# EAGLE design oneboard (EAGLE 6.1)
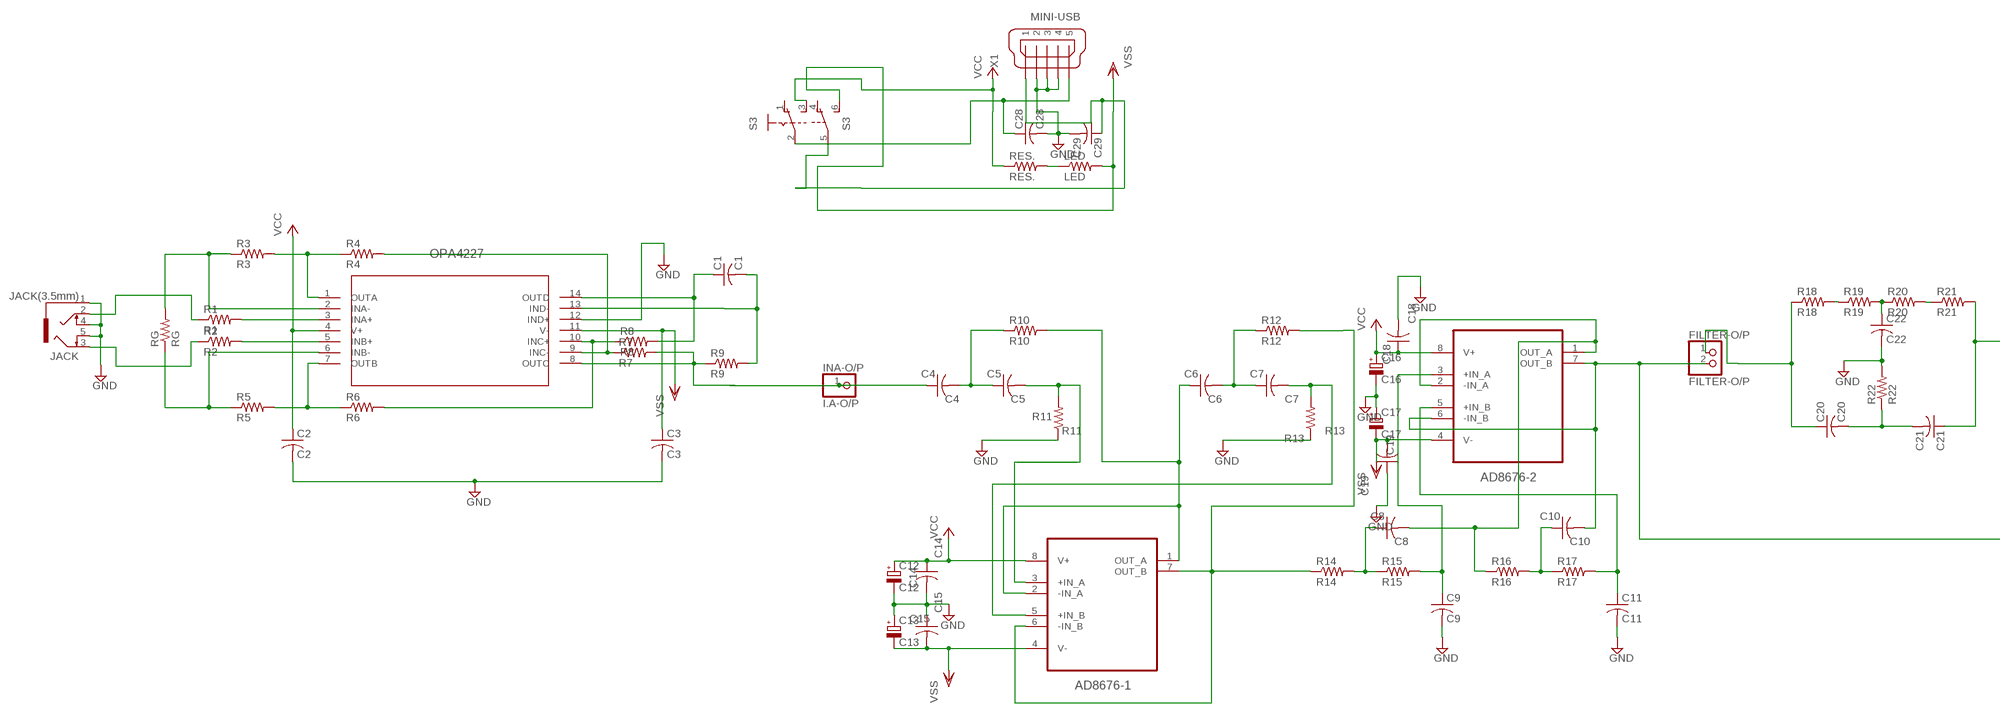
[diagram p0: schematic, sheet 1, part 1 of 2]
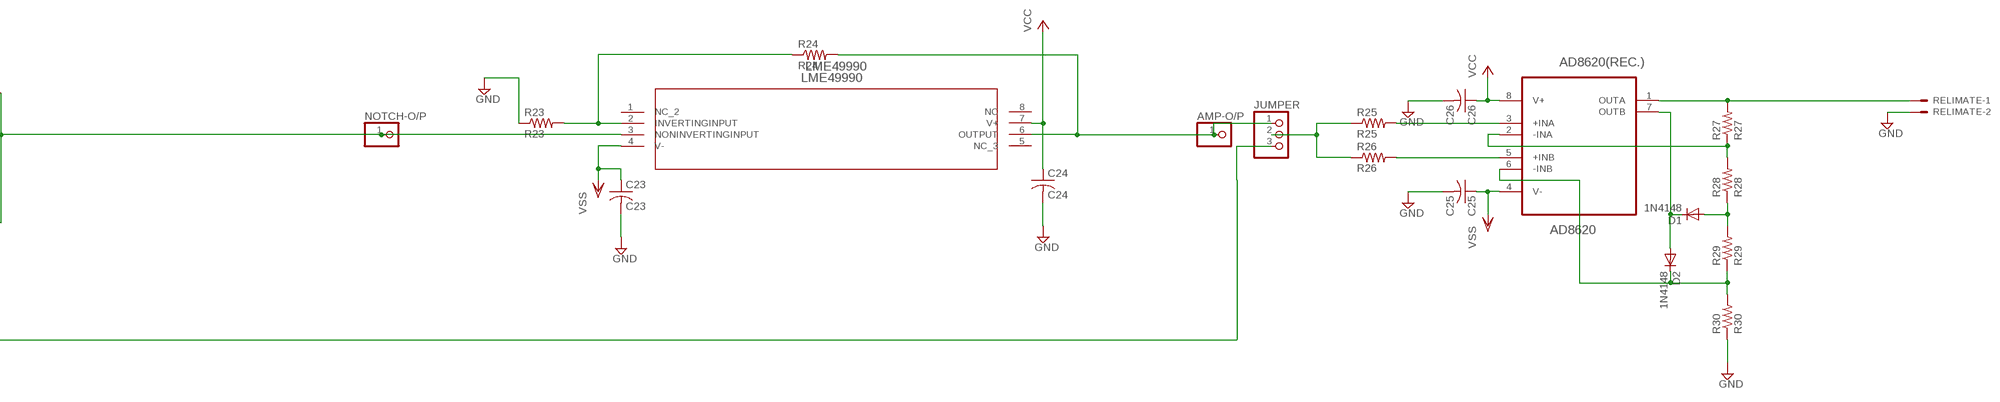
[diagram p1: schematic, sheet 1, part 2 of 2]

## Parts
AD8620(REC.)  AD8620  AD8620ARZ  [SOIC127P600X175-8N]
AD8676-1  AD8676-1  AD8676ARZ  [SOIC127P600X175-8N]
AD8676-2  AD8676-2  AD8676ARZ  [SOIC127P600X175-8N]
AMP-O/P  PINHD-1X1  [1X01]
C1  C1  C-USC0603  [C0603]
C2  C2  C-USC0603  [C0603]
C3  C3  C-USC0603  [C0603]
C4  C4  C-USC0603  [C0603]
C5  C5  C-USC0603  [C0603]
C6  C6  C-USC0603  [C0603]
C7  C7  C-USC0603  [C0603]
C8  C8  C-USC0603  [C0603]
C9  C9  C-USC0603  [C0603]
C10  C10  C-USC0603  [C0603]
C11  C11  C-USC0603  [C0603]
C12  C12  CPOL-EUE2-5  [E2-5]
C13  C13  CPOL-EUE2-5  [E2-5]
C14  C14  C-USC0603  [C0603]
C15  C15  C-USC0603  [C0603]
C16  C16  CPOL-EUE2-5  [E2-5]
C17  C17  CPOL-EUE2-5  [E2-5]
C18  C18  C-USC0603  [C0603]
C19  C19  C-USC0603  [C0603]
C20  C20  C-USC0603  [C0603]
C21  C21  C-USC0603  [C0603]
C22  C22  C-USC0603  [C0603]
C23  C23  C-USC0603  [C0603]
C24  C24  C-USC0603  [C0603]
C25  C25  C-USC0603  [C0603]
C26  C26  C-USC0603  [C0603]
C28  C28  C-USC0603  [C0603]
C29  C29  C-USC0603  [C0603]
D1  1N4148  1N4148DO35-10  [DO35-10]
D2  1N4148  1N4148DO35-10  [DO35-10]
FILTER-O/P  FILTER-O/P  PINHD-1X2  [1X02]
INA-O/P  I.A-O/P  PINHD-1X1  [1X01]
JACK  JACK(3.5mm)  1503_09  [1503_09]
JUMPER  PINHD-1X3  [1X03]
LED  LED  R-US_R0805  [R0805]
LME49990  LME49990  LME49990_D_8  [M08A]
NOTCH-O/P  PINHD-1X1  [1X01]
OPA4227  OPA4277_D_14  [D14]
R1  R1  R-US_R0603  [R0603]
R2  R2  R-US_R0603  [R0603]
R3  R3  R-US_R0603  [R0603]
R4  R4  R-US_R0603  [R0603]
R5  R5  R-US_R0603  [R0603]
R6  R6  R-US_R0603  [R0603]
R7  R7  R-US_R0603  [R0603]
R8  R8  R-US_R0603  [R0603]
R9  R9  R-US_R0603  [R0603]
R10  R10  R-US_R0603  [R0603]
R11  R11  R-US_R0603  [R0603]
R12  R12  R-US_R0603  [R0603]
R13  R13  R-US_R0603  [R0603]
R14  R14  R-US_R0603  [R0603]
R15  R15  R-US_R0603  [R0603]
R16  R16  R-US_R0603  [R0603]
R17  R17  R-US_R0603  [R0603]
R18  R18  R-US_R0603  [R0603]
R19  R19  R-US_R0603  [R0603]
R20  R20  R-US_R0603  [R0603]
R21  R21  R-US_R0603  [R0603]
R22  R22  R-US_R0603  [R0603]
R23  R23  R-US_R0603  [R0603]
R24  R24  R-US_R0603  [R0603]
R25  R25  R-US_R0603  [R0603]
R26  R26  R-US_R0603  [R0603]
R27  R27  R-US_R0603  [R0603]
R28  R28  R-US_R0603  [R0603]
R29  R29  R-US_R0603  [R0603]
R30  R30  R-US_R0603  [R0603]
RELIMATE  22-23-2021  [22-23-2021]
RES.  RES.  R-US_R0603  [R0603]
RG  RG  R-US_R0603  [R0603]
S3  A68-A31  [A68-A31]
X1  MINI-USB  MINI-USB-UX60-MB-5S8  [UX60-MB-5S8]

## Nets
1: C21.1 LME49990.3(NONINVERTINGINPUT) NOTCH-O/P.1 R21.2
5: C29.1 S3.5(B:P) X1.1
GND: C2.2 C3.2 C9.2 C11.2 C12.- C13.+ C14.2 C15.1 C16.- C17.+ C18.2 C19.1 C22.2 C23.2 C24.2 C25.2 C26.2 C28.2 C29.2 JACK.1 JACK.4 JACK.5 OPA4227.12(IND+) R11.1 R13.1 R22.2 R23.1 R30.1 RELIMATE.2 X1.2 X1.3 X1.4
H-O/P: AD8676-1.6(-IN_B) AD8676-1.7(OUT_B) R12.2 R14.1
N$1: OPA4227.3(INA+) R1.2
N$2: OPA4227.5(INB+) R2.2
N$3: JACK.3 R2.1
N$4: JACK.2 R1.1
N$5: OPA4227.1(OUTA) R3.2 R4.1
N$6: OPA4227.2(INA-) R3.1 RG.2
N$7: OPA4227.9(INC-) R4.2 R7.1
N$9: OPA4227.6(INB-) R5.1 RG.1
N$10: OPA4227.10(INC+) R6.2 R8.1
N$11: C1.2 OPA4227.13(IND-) R9.2
N$12: C4.2 C5.1 R10.1
N$13: C1.1 OPA4227.14(OUTD) R8.2
N$14: C4.1 INA-O/P.1 OPA4227.8(OUTC) R7.2 R9.1
N$15: AD8676-1.3(+IN_A) C5.2 R11.2
N$16: AD8676-1.1(OUT_A) AD8676-1.2(-IN_A) C6.1 R10.2
N$17: C6.2 C7.1 R12.1
N$18: AD8676-1.5(+IN_B) C7.2 R13.2
N$19: C8.1 R14.2 R15.1
N$20: AD8676-2.3(+IN_A) C9.1 R15.2
N$21: C10.1 R16.2 R17.1
N$22: AD8676-2.5(+IN_B) C11.1 R17.2
N$23: AD8676-2.1(OUT_A) AD8676-2.2(-IN_A) C8.2 R16.1
N$24: AD8620(REC.).3(+INA) R25.2
N$25: C22.1 R19.2 R20.1
N$26: LED.1 RES..2
N$27: C20.2 C21.2 R22.1
N$28: R18.2 R19.1
N$29: R20.2 R21.1
N$30: AD8620(REC.).5(+INB) R26.2
N$31: JUMPER.2 R25.1 R26.1
N$32: AD8676-2.6(-IN_B) AD8676-2.7(OUT_B) C10.2 FILTER-O/P.2 JUMPER.3
N$33: C20.1 FILTER-O/P.1 R18.1
N$34: AD8620(REC.).2(-INA) R27.1 R28.2
N$35: AD8620(REC.).1(OUTA) R27.2 RELIMATE.1
N$36: D1.A R28.1 R29.2
N$37: AD8620(REC.).6(-INB) D2.C R29.1 R30.2
N$38: AD8620(REC.).7(OUTB) D1.C D2.A
N$39: LME49990.2(INVERTINGINPUT) R23.2 R24.1
N$40: AMP-O/P.1 JUMPER.1 LME49990.6(OUTPUT) R24.2
N$41: C28.1 S3.2(A:P) X1.5
R6: OPA4227.7(OUTB) R5.2 R6.1
VCC: AD8620(REC.).8(V+) AD8676-1.8(V+) AD8676-2.8(V+) C2.1 C12.+ C14.1 C16.+ C18.1 C24.1 C26.1 LME49990.7(V+) OPA4227.4(V+) RES..1 S3.3(A:S)
VSS: AD8620(REC.).4(V-) AD8676-1.4(V-) AD8676-2.4(V-) C3.1 C13.- C15.2 C17.- C19.2 C23.1 C25.1 LED.2 LME49990.4(V-) OPA4227.11(V-) S3.6(B:S)
Unconnected: LME49990.1(NC_2) LME49990.5(NC_3) LME49990.8(NC) S3.1(A:O) S3.4(B:O)

## Library data of the parts
AD8620(REC.) = Analog Devices_By_element14_Batch_1:AD8620ARZ: Precision, Very Low Noise,Low Input Bias Current, Wide Bandwidth JFET Operational Amplifiers; MPN: AD8620ARZ; OC_FARNELL: 9994386; OC_NEWARK: 59K6972; PACKAGE: SOIC-8; SUPPLIER: Analog Devices
AD8676-1 AD8676-2 = Analog Devices_By_element14_Batch_1:AD8676ARZ: Ultraprecision, 36 V, 2.8 nV/ãHz Dual Rail-to-Rail Output Op Amp; MPN: AD8676ARZ; OC_FARNELL: 1316453; OC_NEWARK: 28M4146; PACKAGE: SOIC-8; SUPPLIER: Analog Devices
AMP-O/P INA-O/P NOTCH-O/P = pinhead:PINHD-1X1: PIN HEADER
C1-C11 C14 C15 C18-C26 C28 C29 = rcl:C-US: CAPACITOR, American symbol
C12 C13 C16 C17 = rcl:CPOL-EU: POLARIZED CAPACITOR, European symbol
D1 D2 = diode:1N4148: DIODE high speed (Philips)
FILTER-O/P = pinhead:PINHD-1X2: PIN HEADER
JACK = con-lumberg:1503_09: Jack connectors according to JISC 6560, 3.5 mm Klinkeneinbaukupplung nach JISC 6560, 3,5 mm, 3-polig/ stereo, abgewinkelte Ausführung, mit 2 Öffnern und Lötaugen, für Leiterplatten Rückseitenmontage Source: http://www.lumberg.com/Produkte/PDFs/1503_09.pdf; OC_FARNELL: 1243244; OC_NEWARK: unknown
JUMPER = pinhead:PINHD-1X3: PIN HEADER
LED R10-R30 RES. = rcl:R-US_: RESISTOR, American symbol
LME49990 = lme49990:LME49990_D_8; BASEPN: LME49990; DATASHEETURL: http://www.ti.com/lit/ds/symlink/lme49990.pdf; DESCRIPTION: Ultra-low Distortion, Ultra-low Noise Operational Amplifier; MANUFACTURER: Texas Instruments; MANUFACTURER_PART_NUMBER: lme49990_d_8; NSC_PACKAGEREFERENCE: M08A; VENDOR: Texas Instruments
OPA4227 = OPA4277_SOIC:OPA4277_D_14; DATASHEETURL: http://www.ti.com/lit/gpn/OPA4277; DESCRIPTION: High Precision Operational Amplifiers; FAMILY_NAME: LOW OFFSET VOLTAGE; GENERIC_PART_NUMBER: OPA4277; INDUSTRY_STD_PKG_TYPE: SOIC; MANUFACTURER: Texas Instruments; MANUFACTURER_PART_NUMBER: opa4277_d_14; PACKAGE_DESIGNATOR: D; PIN_COUNT: 14; VENDOR: Texas Instruments
R1-R9 RG = resistor:R-US_: RESISTOR, American symbol
RELIMATE = con-molex:22-23-2021: .100" (2.54mm) Center Header - 2 Pin; MF: MOLEX; MPN: 22-23-2021; OC_FARNELL: 1462926; OC_NEWARK: 25C3832
S3 = switch:A68-A31: SLIDING SWITCH Siemens, distributor Buerklin, 11G766
X1 = con-hirose:MINI-USB-: MINI USB Connector Source: http://www.hirose.co.jp/cataloge_hp/e24000019.pdf; OC_FARNELL: unknown; OC_NEWARK: unknown

## Board
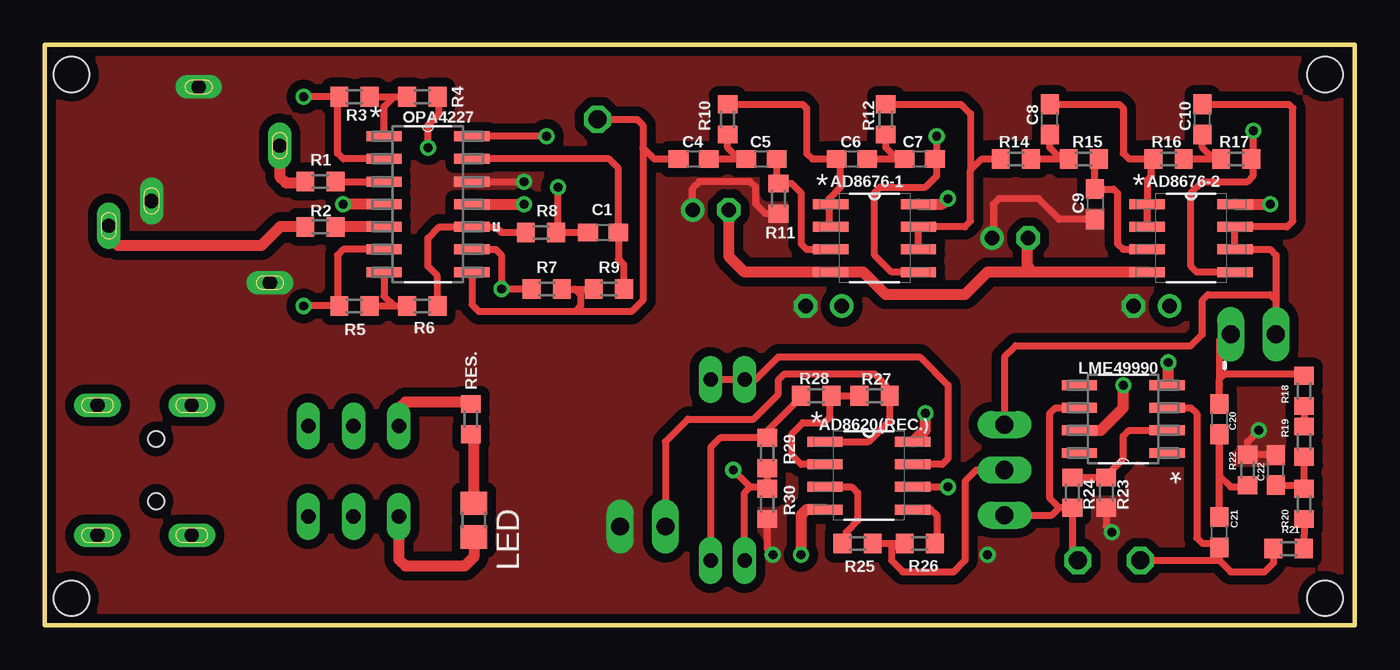
[diagram p2: board, top side]
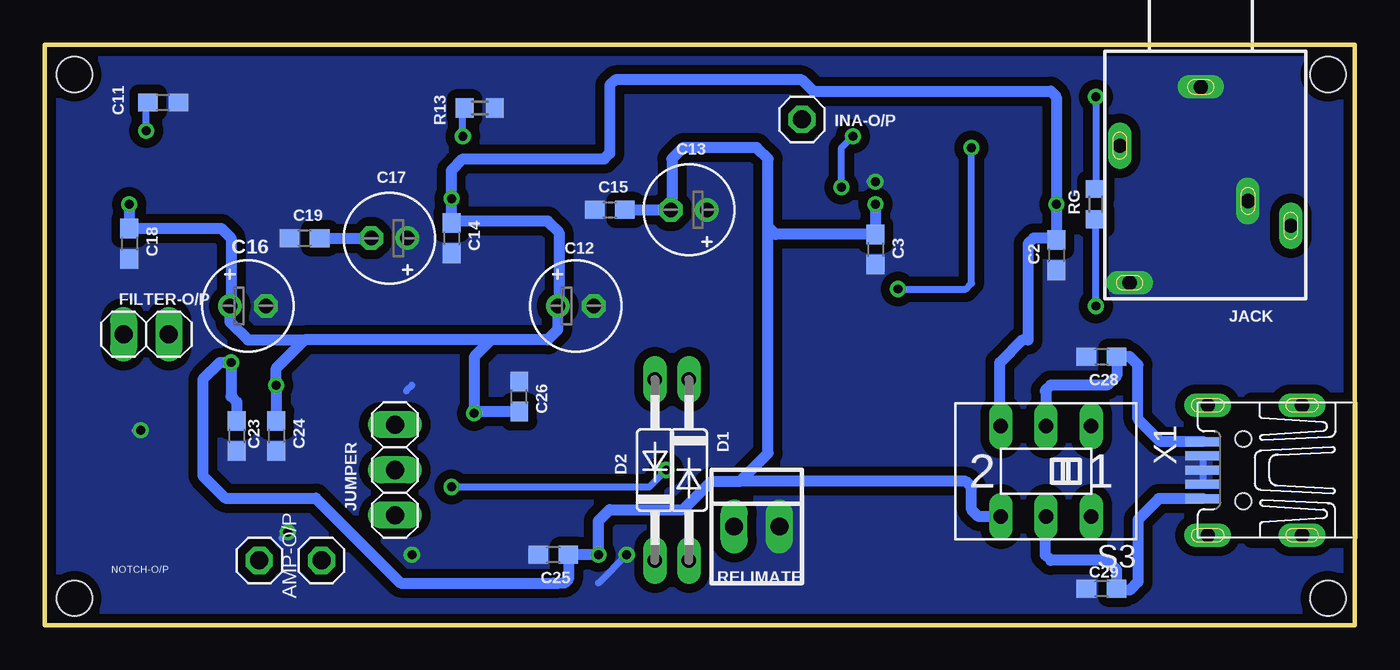
[diagram p3: board, bottom side, seen from below]

Size 73.61 x 32.61 mm. Coordinates in mm from the lower left corner, seen from the top.
Outline: 0,0 0,32.61 73.61,32.61 73.61,0 0,0
Copper layers (1*16): Top 0.035mm / dielectric 1.6mm / Bottom 0.035mm
Design rules: minimum track width 10mil, minimum drill 15mil, track to track 6mil, track to pad 6mil, pad to pad 6mil, via to via 6mil, smd to smd 0mil, copper to edge 10mil, drill to drill 8mil, minimum pad ring 10mil, minimum via ring 8mil, stop-mask expansion 4mil, vias tented up to drill 0mil, thermal gap 10mil
Holes 2 mm at 1.52,30.94 71.93,30.94 71.93,1.52 1.52,1.52

### Footprints (pad centres in the part's own frame; a part is rotated, then mirrored left to right if it is on the bottom)
SOIC127P600X175-8N = smd 1.981 x 0.559: 1 -2.464,1.905; 2 -2.464,0.635; 3 -2.464,-0.635; 4 -2.464,-1.905; 5 2.464,-1.905; 6 2.464,-0.635; 7 2.464,0.635; 8 2.464,1.905
1X01 = drill 1.016 octagon: 1 0,0
C0603 = smd 1.1 x 1: 1 -0.85,0; 2 0.85,0
E2-5 = drill 0.813 pad 1.27: + -1.016,0 | drill 0.813 pad 1.27 octagon: - 1.016,0
DO35-10 = drill 0.813 long: A 5.08,0; C -5.08,0
1X02 = drill 1.016 long: 1 -1.27,0; 2 1.27,0
1503_09 = drill 0.8 pad 1.2 long: 1 0,-2.1; 2 -4.55,-5.4; 3 5.05,-9.9; 4 -4,-13.1; 5 2.65,-8.5
1X03 = drill 1.016 long: 1 -2.54,0; 2 0,0; 3 2.54,0
R0805 = smd 1.3 x 1.5: 1 -0.95,0; 2 0.95,0
M08A = smd 1.981 x 0.559: 1 -2.464,1.905; 2 -2.464,0.635; 3 -2.464,-0.635; 4 -2.464,-1.905; 5 2.464,-1.905; 6 2.464,-0.635; 7 2.464,0.635; 8 2.464,1.905
D14 = smd 1.981 x 0.559: 1 -2.464,3.81; 2 -2.464,2.54; 3 -2.464,1.27; 4 -2.464,0; 5 -2.464,-1.27; 6 -2.464,-2.54; 7 -2.464,-3.81; 8 2.464,-3.81; 9 2.464,-2.54; 10 2.464,-1.27; 11 2.464,0; 12 2.464,1.27; 13 2.464,2.54; 14 2.464,3.81
R0603 = smd 1 x 1.1: 1 -0.85,0; 2 0.85,0
22-23-2021 = drill 1 long: 1 -1.27,0; 2 1.27,0
A68-A31 = drill 0.813 long: 1 -2.54,-2.54; 2 0,-2.54; 3 2.54,-2.54; 4 -2.54,2.54; 5 0,2.54; 6 2.54,2.54
UX60-MB-5S8 = smd 2 x 0.5: 1 8.65,1.6; 2 8.65,0.8; 3 8.65,0; 4 8.65,-0.8; 5 8.65,-1.6 | drill 0.8 long: M1 3.1,-3.65; M2 3.1,3.65; M3 8.4,3.65; M4 8.4,-3.65 | hole 0.9: 6.4,-1.75; 6.4,1.75

### Placement (x,y rotation side)
AD8620(REC.)  46.3,8.41 0 top
AD8676-1  46.62,21.74 0 top
AD8676-2  64.4,21.74 0 top
AMP-O/P  58.05,3.64 0 bottom
C1  31.38,22.06 0 top
C2  16.78,20.79 270 bottom
C3  26.94,21.11 270 bottom
C4  36.46,26.19 0 top
C5  40.27,26.19 0 top
C6  45.35,26.19 0 top
C7  49.16,26.19 0 top
C8  56.46,28.41 90 top
C9  59,23.65 270 top
C10  65.04,28.41 90 top
C11  66.94,29.36 0 bottom
C12  43.76,17.93 0 bottom
C13  37.41,23.33 180 bottom
C14  50.75,21.74 270 bottom
C15  41.86,23.33 0 bottom
C16  62.18,17.93 0 bottom
C17  54.24,21.74 180 bottom
C18  68.85,21.42 270 bottom
C19  59,21.74 0 bottom
C20  65.99,11.58 270 top
C21  65.99,5.23 90 top
C22  69.16,8.72 90 top
C23  62.81,10.63 270 bottom
C24  60.59,10.63 270 bottom
C25  45.03,3.96 180 bottom
C26  46.94,12.85 90 bottom
C28  14.24,15.07 180 bottom
C29  14.24,2.06 180 bottom
D1  37.41,8.72 270 bottom
D2  39.32,8.72 90 bottom
FILTER-O/P  67.89,16.34 180 bottom
INA-O/P  31.06,28.41 0 bottom
JACK  8.66,32.33 0 bottom
JUMPER  53.92,8.72 90 bottom
LED  24.12,5.91 270 top
LME49990  60.59,11.58 180 top
NOTCH-O/P  61.54,3.64 0 bottom
OPA4227  21.54,23.65 0 top
R1  15.51,24.92 0 top
R2  15.51,22.38 0 top
R3  17.41,29.68 0 top
R4  21.22,29.68 0 top
R5  17.41,17.93 0 top
R6  21.22,17.93 0 top
R7  28.21,18.88 0 top
R8  27.89,22.06 0 top
R9  31.7,18.88 0 top
R10  38.37,28.41 90 top
R11  41.22,23.96 90 top
R12  47.26,28.41 90 top
R13  49.16,29.04 180 bottom
R14  54.56,26.19 0 top
R15  58.37,26.19 0 top
R16  63.13,26.19 0 top
R17  66.94,26.19 0 top
R18  70.75,13.17 270 top
R19  70.75,10.31 270 top
R20  70.75,6.82 270 top
R21  69.88,4.31 180 top
R22  67.58,8.72 90 top
R23  59.64,7.45 90 top
R24  57.73,7.45 270 top
R25  45.67,4.6 180 top
R26  49.16,4.6 0 top
R27  46.62,12.89 0 top
R28  43.35,12.89 0 top
R29  40.59,9.68 90 top
R30  40.59,6.82 90 top
RELIMATE  33.6,5.55 0 bottom
RES.  23.95,11.58 270 top
RG  14.55,23.65 90 bottom
S3  17.36,8.65 180 bottom
X1  -0.13,8.71 180 bottom

### Tracks (layer width: path | path; a pad name or v marks a point on that pad's centre or on a via)
1
  Top 0.406: 65.99,3.65 C21.1 65.77,4.6 65.04,4.6 64.72,4.92 64.72,11.9 64.4,12.22 LME49990.3 | 65.99,3.65 66.62,3.01 68.54,3.01 69.03,3.49 R21.2 | NOTCH-O/P.1 65.99,3.65
5
  Bottom 0.61: S3.5 17.41,6.11 17.41,3.96 17.09,3.65 13.92,3.65 13.39,3.11 C29.1 13.31,1.98 12.65,1.98 12.19,2.44 12.19,5.94 11.02,7.11 X1.1
GND  (via drill 0.5)
  Top 0.406: R30.1 40.59,4.28 v40.91,3.96 | OPA4227.12 v26.94,24.92 | R11.1 40.49,23.11 39.95,23.65 39.95,24.6 39.64,24.92 36.78,24.92 36.4,24.54 C13.+ | R23.1 59.64,5.55 v59.96,5.23 | C22.2 R22.2 67.58,10.31 v68.21,10.95 | C9.2 57,22.8 55.83,23.96 53.61,23.96 53.29,23.65 53.29,21.81 C17.+
  Bottom 0.406: v40.91,3.96 42.49,2.38 | 52.97,13.49 53.29,13.17 | v26.94,24.92 27.25,24.92 | v59.96,5.23 60.27,4.92 | v68.21,10.95 68.53,10.95 | X1.2 X1.3 X1.4
  other vias: 52.97,3.96
  pour Bottom (isolate 0.508, no thermals): 0.61,1.52 0.61,31.24 1.37,32 72.09,32 73.15,30.94 73.15,1.37 72.24,0.46 1.68,0.46
  pour Top (isolate 0.508, no thermals): 0.61,1.37 0.61,31.09 1.68,32.16 71.93,32.16 73.15,30.94 73.15,1.22 72.39,0.46 1.52,0.46
H-O/P
  Top 0.406: AD8676-1.6 AD8676-1.7 51.7,22.38 52.02,22.7 52.02,25.55 | R12.2 51.49,29.26 52.02,28.73 52.02,25.55 | 52.02,25.55 52.65,26.19 R14.1
N$1
  Top 0.406: R1.2 OPA4227.3
N$2
  Top 0.61: OPA4227.5 R2.2
N$3
  Top 0.61: JACK.3 3.61,21.84 4.12,21.34 12.19,21.34 13.26,22.4 14.63,22.4 | 14.63,22.4 14.78,22.4 | 14.63,22.4 R2.1
N$4
  Top 0.61: JACK.2 13.21,25.19 13.56,24.84 14.58,24.84 R1.1
N$5
  Top 0.406: R3.2 19.63,29.68 | 19.63,29.68 R4.1 20.59,29.68 | OPA4227.1 19.07,29.12 19.63,29.68
N$6  (via drill 0.5)
  Top 0.406: OPA4227.2 16.78,26.19 16.46,26.5 16.46,29.58 R3.1 v14.55,29.68
  Bottom 0.406: v14.55,29.68 RG.2
N$7  (via drill 0.5)
  Top 0.406: v21.54,26.82 21.54,28.09 22.17,28.73 22.17,29.58 R4.2 | OPA4227.9 25.35,21.11 25.67,20.79 v25.67,18.89 R7.1
  Bottom 0.406: v25.67,18.89 21.86,18.89 21.54,19.2 v21.54,26.82
N$9  (via drill 0.5)
  Top 0.406: OPA4227.6 16.78,21.11 16.46,20.79 16.46,18.04 R5.1 v14.55,17.93
  Bottom 0.406: v14.55,17.93 RG.1
N$10
  Top 0.406: R6.2 22.07,19.62 21.54,20.16 21.54,21.74 22.17,22.38 23.44,22.38 23.76,22.38 OPA4227.10 25.35,22.38 25.67,22.06 R8.1
N$11
  Top 0.406: R9.2 32.55,20.26 32.23,20.57 C1.2 32.23,25.66 31.7,26.19 OPA4227.13
N$12
  Top 0.406: C4.2 C5.1 39,26.19 38.37,26.82 R10.1
N$13  (via drill 0.5)
  Top 0.406: C1.1 R8.2 28.84,22.06 v28.84,24.6 | v28.21,27.46 OPA4227.14
  Bottom 0.406: v28.84,24.6 28.84,26.82 v28.21,27.46
N$14
  Top 0.406: 29.79,18.89 R9.1 | OPA4227.8 24,18.01 24.4,17.61 29.79,17.61 | R7.2 29.79,18.89 | 29.79,18.89 30.11,18.57 30.11,17.93 29.79,17.61 | INA-O/P.1 33.29,28.41 33.6,28.09 33.6,26.82 | 33.6,26.82 33.6,18.25 32.97,17.61 29.79,17.61 | 33.6,26.82 34.24,26.19 C4.1
N$15
  Top 0.406: C5.2 41.12,24.92 R11.2 41.96,24.82 42.49,24.28 42.49,21.43 42.81,21.11 AD8676-1.3
N$16
  Top 0.406: R10.2 42.6,29.26 42.81,29.05 42.81,26.5 43.13,26.19 44.4,26.19 | 44.4,26.19 C6.1 | AD8676-1.2 44.08,22.38 44.08,23.65 | 44.08,23.65 44.08,23.96 44.72,24.6 44.72,25.87 44.4,26.19 | 44.08,23.65 AD8676-1.1
N$17
  Top 0.406: C6.2 C7.1 | C7.1 48.53,26.19 | C7.1 47.89,26.19 47.26,26.82 R12.1
N$18  (via drill 0.5)
  Top 0.406: v50.11,27.46 50.11,26.19 C7.2 49.8,26.19 50.11,25.87 50.11,25.23 49.48,24.6 46.94,24.6 46.62,24.28 46.62,20.79 47.57,19.84 AD8676-1.5
  Bottom 0.406: v50.11,27.46 50.11,29.05 R13.2
N$19
  Top 0.406: R14.2 57.1,26.19 | R15.1 57.1,26.19 | 57.1,26.19 56.46,26.82 C8.1
N$20
  Top 0.406: R15.2 59.32,26.19 59,25.87 C9.1 60.06,24.5 60.27,24.28 60.27,21.43 60.59,21.11 AD8676-2.3
N$21
  Top 0.406: 65.67,26.19 R17.1 | R16.2 65.67,26.19 | 65.67,26.19 65.04,26.82 C10.1
N$22  (via drill 0.5)
  Top 0.406: R17.2 67.89,26.19 v67.89,27.77 | R17.2 67.79,25.77 | AD8676-2.5 64.72,19.84 64.4,20.16 64.4,24.28 65.04,24.92 67.58,24.92 67.89,25.23 67.89,25.87 | 67.89,25.87 67.58,26.19 | 67.89,25.87 67.89,26.09 R17.2
  Bottom 0.406: v67.89,27.77 67.89,29.05 C11.1
N$23
  Top 0.406: C8.2 60.38,29.26 60.59,29.05 60.59,26.5 60.91,26.19 R16.1 | 62.5,26.19 R16.1 | AD8676-2.2 AD8676-2.1 61.94,24.99 62.18,25.23 62.18,26.09 R16.1
N$24
  Top 0.406: AD8620(REC.).3 45.35,7.77 45.67,7.46 45.67,5.87 45.03,5.23 45.03,4.81 R25.2
N$25
  Top 0.406: C22.1 70.55,7.88 R20.1 R19.2
N$26
  Top 0.61: LED.1 24.12,10.56 RES..2
N$27
  Top 0.406: C21.2 C20.2 | C20.2 65.99,10.95 | C20.2 65.99,8.41 66.62,7.77 67.47,7.77 R22.1
N$28
  Top 0.406: R18.2 R19.1
N$29
  Top 0.406: R20.2 R21.1
N$30
  Top 0.406: AD8620(REC.).5 49.8,6.5 50.11,6.18 50.11,4.7 R26.2
N$31
  Top 0.406: 47.57,4.6 R26.1 48.21,4.6 | R25.1 47.57,4.6 | 47.57,4.6 47.57,4.28 | 48.53,4.6 47.89,4.6 47.57,4.28 | 47.57,4.28 47.57,3.65 48.21,3.01 51.07,3.01 51.7,3.65 51.7,8.09 52.34,8.72 JUMPER.2
N$32
  Top 0.406: C10.2 69.9,29.26 70.12,29.05 70.12,22.7 69.8,22.38 AD8676-2.7 AD8676-2.6 68.85,21.11 69.16,20.79 69.16,18.25 | 69.16,18.25 68.85,18.57 65.35,18.57 65.04,18.25 65.04,16.34 64.4,15.71 54.56,15.71 53.92,15.07 JUMPER.3 | 69.16,18.25 FILTER-O/P.2
N$33
  Top 0.406: C20.1 65.99,13.49 65.99,13.8 | 65.99,13.8 66.31,14.12 70.65,14.12 R18.1 | FILTER-O/P.1 66.31,16.34 65.99,16.03 65.99,13.8
N$34
  Top 0.406: R27.1 R28.2 44.12,12.81 44.12,11.68 43.81,11.38 42.6,11.38 41.99,10.77 41.99,9.55 42.49,9.04 AD8620(REC.).2
N$35
  Top 0.406: AD8620(REC.).1 46.3,10.31 47.47,11.48 R27.2 47.26,12.75 47.26,13.49 46.62,14.12 41.56,14.12 41.22,13.78 41.22,12.99 39.82,11.58 36.14,11.58 34.87,10.31 RELIMATE.1
N$36
  Top 0.406: D1.A 37.41,9.99 37.95,10.53 R29.2 40.59,10.63 40.69,10.63 40.69,11 42.29,12.6 42.29,12.9 42.48,12.9 R28.1
N$37  (via drill 0.5)
  Top 0.406: R29.1 R30.2 40.49,7.77 39.64,7.77 | D2.C 39.32,7.46 39.64,7.77 | AD8620(REC.).6 v50.75,7.77 | v38.68,8.72 39.64,7.77
  Bottom 0.406: v50.75,7.77 39.64,7.77 v38.68,8.72
N$38
  Top 0.406: AD8620(REC.).7 50.43,9.04 50.75,9.36 50.75,13.49 49.16,15.07 41.22,15.07 39.95,13.8 D2.A D1.C
N$39
  Top 0.406: R24.1 59.54,8.3 59.64,8.41 | 59.64,8.41 60.59,9.36 60.59,10.63 60.91,10.95 LME49990.2 | 59.64,8.41 R23.2
N$40
  Top 0.406: 57,6.61 R24.2 57.73,3.96 AMP-O/P.1 | 57,6.61 56.46,7.14 56.46,11.9 56.78,12.22 LME49990.6 | 57,6.61 56.58,6.18 JUMPER.1
N$41
  Bottom 0.61: S3.2 17.36,13.17 17.41,13.17 17.09,13.49 13.92,13.49 13.39,14.02 C28.1 13.37,15.09 13.26,15.09 | X1.5 10.92,10.31 12.19,11.58 12.19,14.63 12.65,15.09 13.26,15.09 | 13.26,15.09 13.41,14.94
R6
  Top 0.406: R5.2 19.63,17.93 | 19.63,17.93 R6.1 | OPA4227.7 19.07,18.49 19.63,17.93
VCC  (via drill 0.5)
  Top 0.61: OPA4227.4 v16.78,23.65 | AD8676-1.8 50.43,23.65 v50.75,23.96 | AD8676-2.8 v68.85,23.65 | LME49990.7 59.32,10.95 60.59,12.22 v60.59,13.49 | RES..1 23.85,12.54 20.27,12.54 19.95,12.22 19.9,12.22 S3.3 | AD8620(REC.).8 49.48,11.02 v49.48,11.9 49.48,10.95 48.84,10.31 AD8620(REC.).8
  Bottom 0.406: 50.65,22.7 C14.1 50.75,22.7 | C2.1 17.31,21.64 17.41,21.74 | C12.+ 44.72,17.93
  Bottom 0.61: 48.53,16.03 59,16.03 | C26.1 49.38,12 v49.48,11.9 49.48,15.07 48.53,16.03 | 44.72,17.93 44.72,22.06 45.35,22.7 50.75,22.7 v50.75,23.96 50.75,25.55 50.11,26.19 42.18,26.19 41.86,26.5 41.86,30.32 41.54,30.63 31.06,30.63 30.43,30 17.09,30 16.78,29.68 v16.78,23.65 16.78,21.74 17.41,21.74 18.05,21.74 18.36,21.43 18.36,16.03 18.68,16.03 19.95,14.76 19.95,11.19 S3.3 | C12.+ 44.78,16.6 45.35,16.03 48.53,16.03 | 68.74,22.27 63.66,22.27 63.13,21.74 63.13,18 C16.+ 63.2,17.04 62.18,16.03 59,16.03 | 68.74,22.27 68.85,22.38 | 68.74,22.27 C18.1 v68.85,23.65 | 60.59,11.27 C24.1 v60.59,13.49 60.59,14.44 59,16.03
VSS  (via drill 0.5)
  Top 0.61: OPA4227.11 v26.94,23.65 | C13.- 38.43,20.73 39.32,19.84 AD8676-1.4 45.99,19.84 47.26,18.57 51.7,18.57 52.97,19.84 55.51,19.84 | AD8676-2.4 55.51,19.84 | C17.- 55.19,21.68 55.19,20.16 55.51,19.84 | LME49990.4 63.13,13.49 v63.13,14.76 | AD8620(REC.).4 42.81,6.5 42.49,6.18 v42.49,3.96 | S3.6 19.9,3.69 20.27,3.33 23.6,3.33 24.12,3.85 LED.2
  Bottom 0.406: C3.1 26.94,22.06
  Bottom 0.61: v26.94,23.65 26.94,22.06 | C3.1 32.55,21.96 32.97,22.38 | 32.97,22.38 32.97,26.19 33.6,26.82 37.73,26.82 38.37,26.19 38.37,23.33 C13.- C15.2 | C19.2 C17.- | C23.1 62.81,12.54 63.13,12.85 v63.13,14.76 63.77,14.76 64.72,13.8 64.72,8.41 63.45,7.14 58.37,7.14 53.61,2.38 45.03,2.38 44.72,2.38 44.4,2.38 44.18,2.59 C25.1 v42.49,3.96 42.49,5.87 41.86,6.5 37.73,6.5 36.14,8.09 34.87,8.09 34.56,8.09 | 34.56,8.09 32.97,9.68 32.97,22.38 | 34.56,8.09 21.86,8.09 21.54,7.77 21.54,6.5 21.15,6.11 S3.6

### Text on the board
tValues: INSTRUMENTATION AMP. | HIGH PASS AND LOW PASS FILTER | DAR | NOTCH FILTER | Designed By: | POWER SUPPLY | SUPPLY SWITCH | LED | FINAL OUTPUT | RECTIFIER | SWITCH | AMPLIFIER
bValues: INSTRUMENTATION AMP. | HIGH PASS AND LOW PASS FILTER | NOTCH FILTER | DAR | Designed By: | POWER SUPPLY | SUPPLY SWITCH | LED | FINAL OUTPUT | RECTIFIER | SWITCH | AMPLIFIER